# Altium schematic sheet PlusBit_ExtraModule.SchDoc
size A4; SheetNumber: 3; SheetTotal: 5
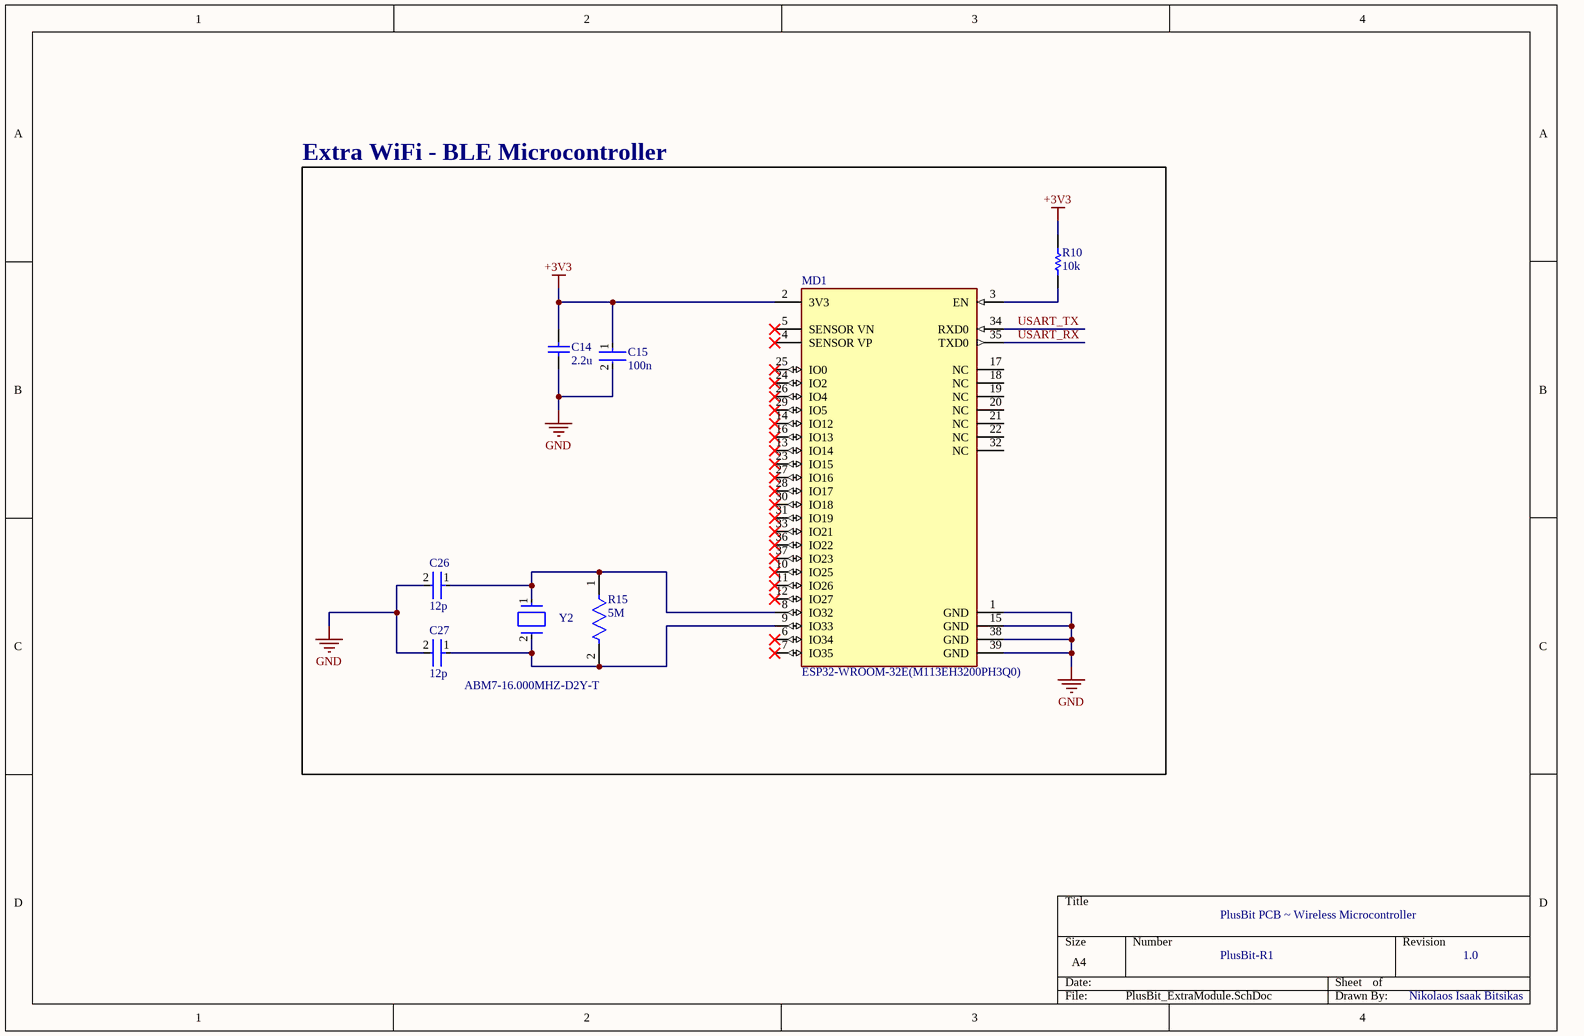
[diagram p0: PlusBit_ExtraModule.SchDoc]

## Parts
C14  2.2u  [CAPC2013X145X50ML20T25]
C15  100n  [FP-C0402-BB-MFG]
C26  12p  [FP-C0402-BB-MFG]
C27  12p  [FP-C0402-BB-MFG]
MD1  ESP32-WROOM-32E(M113EH3200PH3Q0)  [FP-ESP32-WROOM-32E_M113EH-MFG]
R10  10k  [RESC1608X55X25ML10T15]
R15  5M  [FP-WSLP0805-MFG]
Y2  ABM7-16.000MHZ-D2Y-T  [FP-ABM7-MFG]

## Blocks framed on the sheet
Extra WiFi - BLE Microcontroller: C14 C15 C26 C27 MD1 R10 R15 Y2

## Nets
+3V3: C14.2 C15.1 MD1.2(3V3) R10.2
GND: C14.1 C15.2 C26.2 C27.2 MD1.1(GND) MD1.15(GND) MD1.38(GND) MD1.39(GND)
USART_RX: MD1.35(TXD0)
USART_TX: MD1.34(RXD0)
NetC26_1: C26.1 MD1.8(IO32) R15.1 Y2.1
NetC27_1: C27.1 MD1.9(IO33) R15.2 Y2.2
NetMD1_3: MD1.3(EN) R10.1

Not connected (* = marked no-connect by the designer): MD1 4(SENSOR_VP)* 5(SENSOR_VN)* 6(IO34)* 7(IO35)* 10(IO25)* 11(IO26)* 12(IO27)* 13(IO14)* 14(IO12)* 16(IO13)* 17(NC) 18(NC) 19(NC) 20(NC) 21(NC) 22(NC) 23(IO15)* 24(IO2)* 25(IO0)* 26(IO4)* 27(IO16)* 28(IO17)* 29(IO5)* 30(IO18)* 31(IO19)* 32(NC) 33(IO21)* 36(IO22)* 37(IO23)*

## Notes on the sheet
- PlusBit PCB ~ Wireless Microcontroller
- PlusBit-R1
- 1.0
- Nikolaos Isaak Bitsikas

## Library data of the parts
C14 = CMP-1036-04819-2: Part Number: C0805C225K9PACTU; Manufacturer: Kemet
C15 = CMP-2008-02046-2: CAP CER 0.1UF 10V X5R 0402; Manufacturer: Kemet; Manufacturer Part Number: C0402C104K8PACTU; Material: Ceramic; Capacitance: 0.10 μF; Temperature Coefficient: 15%; Tolerance: 0.1; Value: 0.10 μF; Package: C0402-BB; Temperature: -55°C to +125°C; ComponentLink2Description: Datasheet; Temperature Characteristic: X5R; Device Class L1: Passive Components; Height: 0.55mm; Lead Free: Yes; ComponentLink2URL: https://content.kemet.com/datasheets/KEM_C1002_X7R_SMD.pdf; Device Class L2: Capacitors; Temperature Range Low: -55°C; Temperature Range High: +125°C; RoHS: TRUE; Octopart: https://octopart.com/c0402c104k8pactu-kemet-140039; Automotive: No; Mouser Description: Capacitor 100 nF 10 VDC 0402; Category: Cap; Voltage Rating: 10 V; Digikey Description: CAP CER 0.1UF 10V X5R 0402; Ipc Land Pattern Name: CAPC10050X50; Device Class L3: Ceramic Capacitors
C26 C27 = CMP-1034-00770-4: CAP CER 12PF 50V C0G/NP0 0402; Manufacturer Part Number: C0402C120J5GACTU; Manufacturer: Kemet; Material: Ceramic; Temperature Coefficient: 15%; Temperature Characteristic: C0G; Tolerance: 0.05; Device Class L1: Passive Components; Octopart: https://octopart.com/c0402c120j5gactu-kemet-141377; Device Class L2: Capacitors; Value: 12 pF; Category: Cap; Package: C0402-BB; Automotive: No; ComponentLink2URL: https://content.kemet.com/datasheets/KEM_C1002_X7R_SMD.pdf; Voltage Rating: 50 V; Digikey Description: CAP CER 12PF 50V C0G/NP0 0402; Height: 0.55mm; Temperature: -55°C to +125°C; Mouser Description: Multilayer Ceramic Capacitor, C Series, 12 pF, - 5%, C0G / NP0, 50 V, 0402 [1005 Metric]; ComponentLink2Description: Datasheet; Device Class L3: Ceramic Capacitors; Lead Free: Yes; Ipc Land Pattern Name: CAPC10050X50; Temperature Range High: +125°C; RoHS: TRUE; Temperature Range Low: -55°C; Capacitance: 12 pF
MD1 = CMP-194065-000012-1: RX TXRX MOD WIFI TRACE ANT SMD
R10 = CMP-2000-05022-1: Resistor, 10 KOhm, +/- 5%, 100 mW, -55 to 155 degC, 0603 (1608 Metric), RoHS, Tape and Reel; Manufacturer: Yageo; Resistance: 10kOhms; Voltage Rating: 50V; Temperature Coefficient: 100PPM/C; Power Rating: 100mW; Package Reference: 603; Series: RC; Case Code - mm: 1608; Packaging: Reel; Datasheet URL: http://www.farnell.com/datasheets/443971.pdf; Datasheet Version: Rev. 4, 04/2009; Operating Temperature Range: -55Cto+155C; Product: ThickFilmResistorsGeneralPurpose; Package Description: 2-Pin Surface Mount Device, Body 1.6 x 0.8 mm; Manufacturer URL: http://www.yageo.com/; Case Code - in: 0603; Tolerance: 5%; Termination Style: SMD/SMT
R15 = CMP-02407-013125-1: RES 0.005 OHM 1% 1W 0805; Resistance: 5mR; Temperature Coefficient: 110ppm/°C; Length: 0.08inch; Number of Terminations: 2; Height: 0.023inch; Max Operating Temperature: 170°C; Features: Moisture Resistant; Resistor Type: Metal Strip; Tolerance: 1%; Min Operating Temperature: -65°C; Power Rating: 1W; Width: 0.05inch; Max Power Dissipation: 1W; Case Code (Metric): 2012; Case/Package: 0805; Series: WSLP-HP; Case Code (Imperial): 0805; RoHS Compliant: Yes; Resistance Tolerance: 1%; Packaging: Cut Tape
Y2 = CMP-27762-000095-1: Crystal 16MHz ±20ppm 18pF SMD-2 6mm x 3.5mm; ESR (Equivalent Series Resistance): 50R; Frequency Stability: 30ppm; Width: 3.3mm; Frequency: 16MHz; Radiation Hardening: No; Height: 0.055inch; Tolerance: 20ppm; Length: 6mm; Case/Package: CSMD; Lead Free: Lead Free; Min Operating Temperature: -40°C; Termination: SMD/SMT; Operating Frequency: 16 MHz; Resistor Type: Ceramic; Packaging: Tape and Reel; Mount: Surface Mount; Load Capacitance: 18pF; Frequency Tolerance: 20ppm; Depth: 3.5mm; Series: ABM7; Package Quantity: 1000; Max Operating Temperature: 85°C; Number of Pins: 2